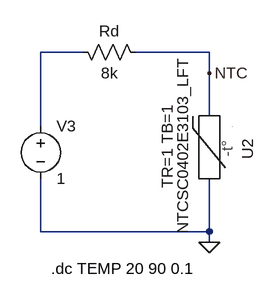
[diagram p0: schematic simulation_NTC_therm_Vishay.asc]
simulation_NTC_therm_Vishay.asc, the LTspice schematic file:
Version 4
SHEET 1 1848 836
WIRE -592 64 -656 64
WIRE -400 64 -512 64
WIRE -400 96 -400 64
WIRE -400 160 -400 96
WIRE -656 176 -656 64
WIRE -656 336 -656 256
WIRE -400 336 -400 256
WIRE -400 336 -656 336
WIRE -400 352 -400 336
FLAG -400 352 0
FLAG -400 96 NTC
SYMBOL res -496 80 M270
WINDOW 0 32 56 VTop 2
WINDOW 3 0 56 VBottom 2
SYMATTR InstName Rd
SYMATTR Value 8k
SYMBOL voltage -656 160 R0
WINDOW 123 0 0 Left 2
WINDOW 39 0 0 Left 2
SYMATTR InstName V3
SYMATTR Value 1
SYMBOL NTCSC0402E3104_XHT -400 208 R90
SYMATTR InstName U2
SYMATTR Value NTCSC0402E3103_LFT
SYMATTR SpiceLine TR=1 TB=1
TEXT -640 392 Left 2 !.dc TEMP 20 90 0.1

The netlist it stands for:
* simulation_NTC_therm_Vishay.asc
Rd NTC N001 8k
V3 N001 0 1
XU2 NTC 0 NTCSC0402E3103_LFT TR=1 TB=1  ; pins RN Rp
.dc TEMP 20 90 0.1
.lib VISHAY_LTSPICE_Therm_MC2.lib
.backanno
.end